# EasyEDA schematic SCH_BlackRacers.json

## Sheets
1 Sheet_1: TITLE: Electrical diagram; REV: 1.0; Date: 2021-05-08; Sheet: 1/1; Drawn By: Korabeynikov; Company: BlackRacers
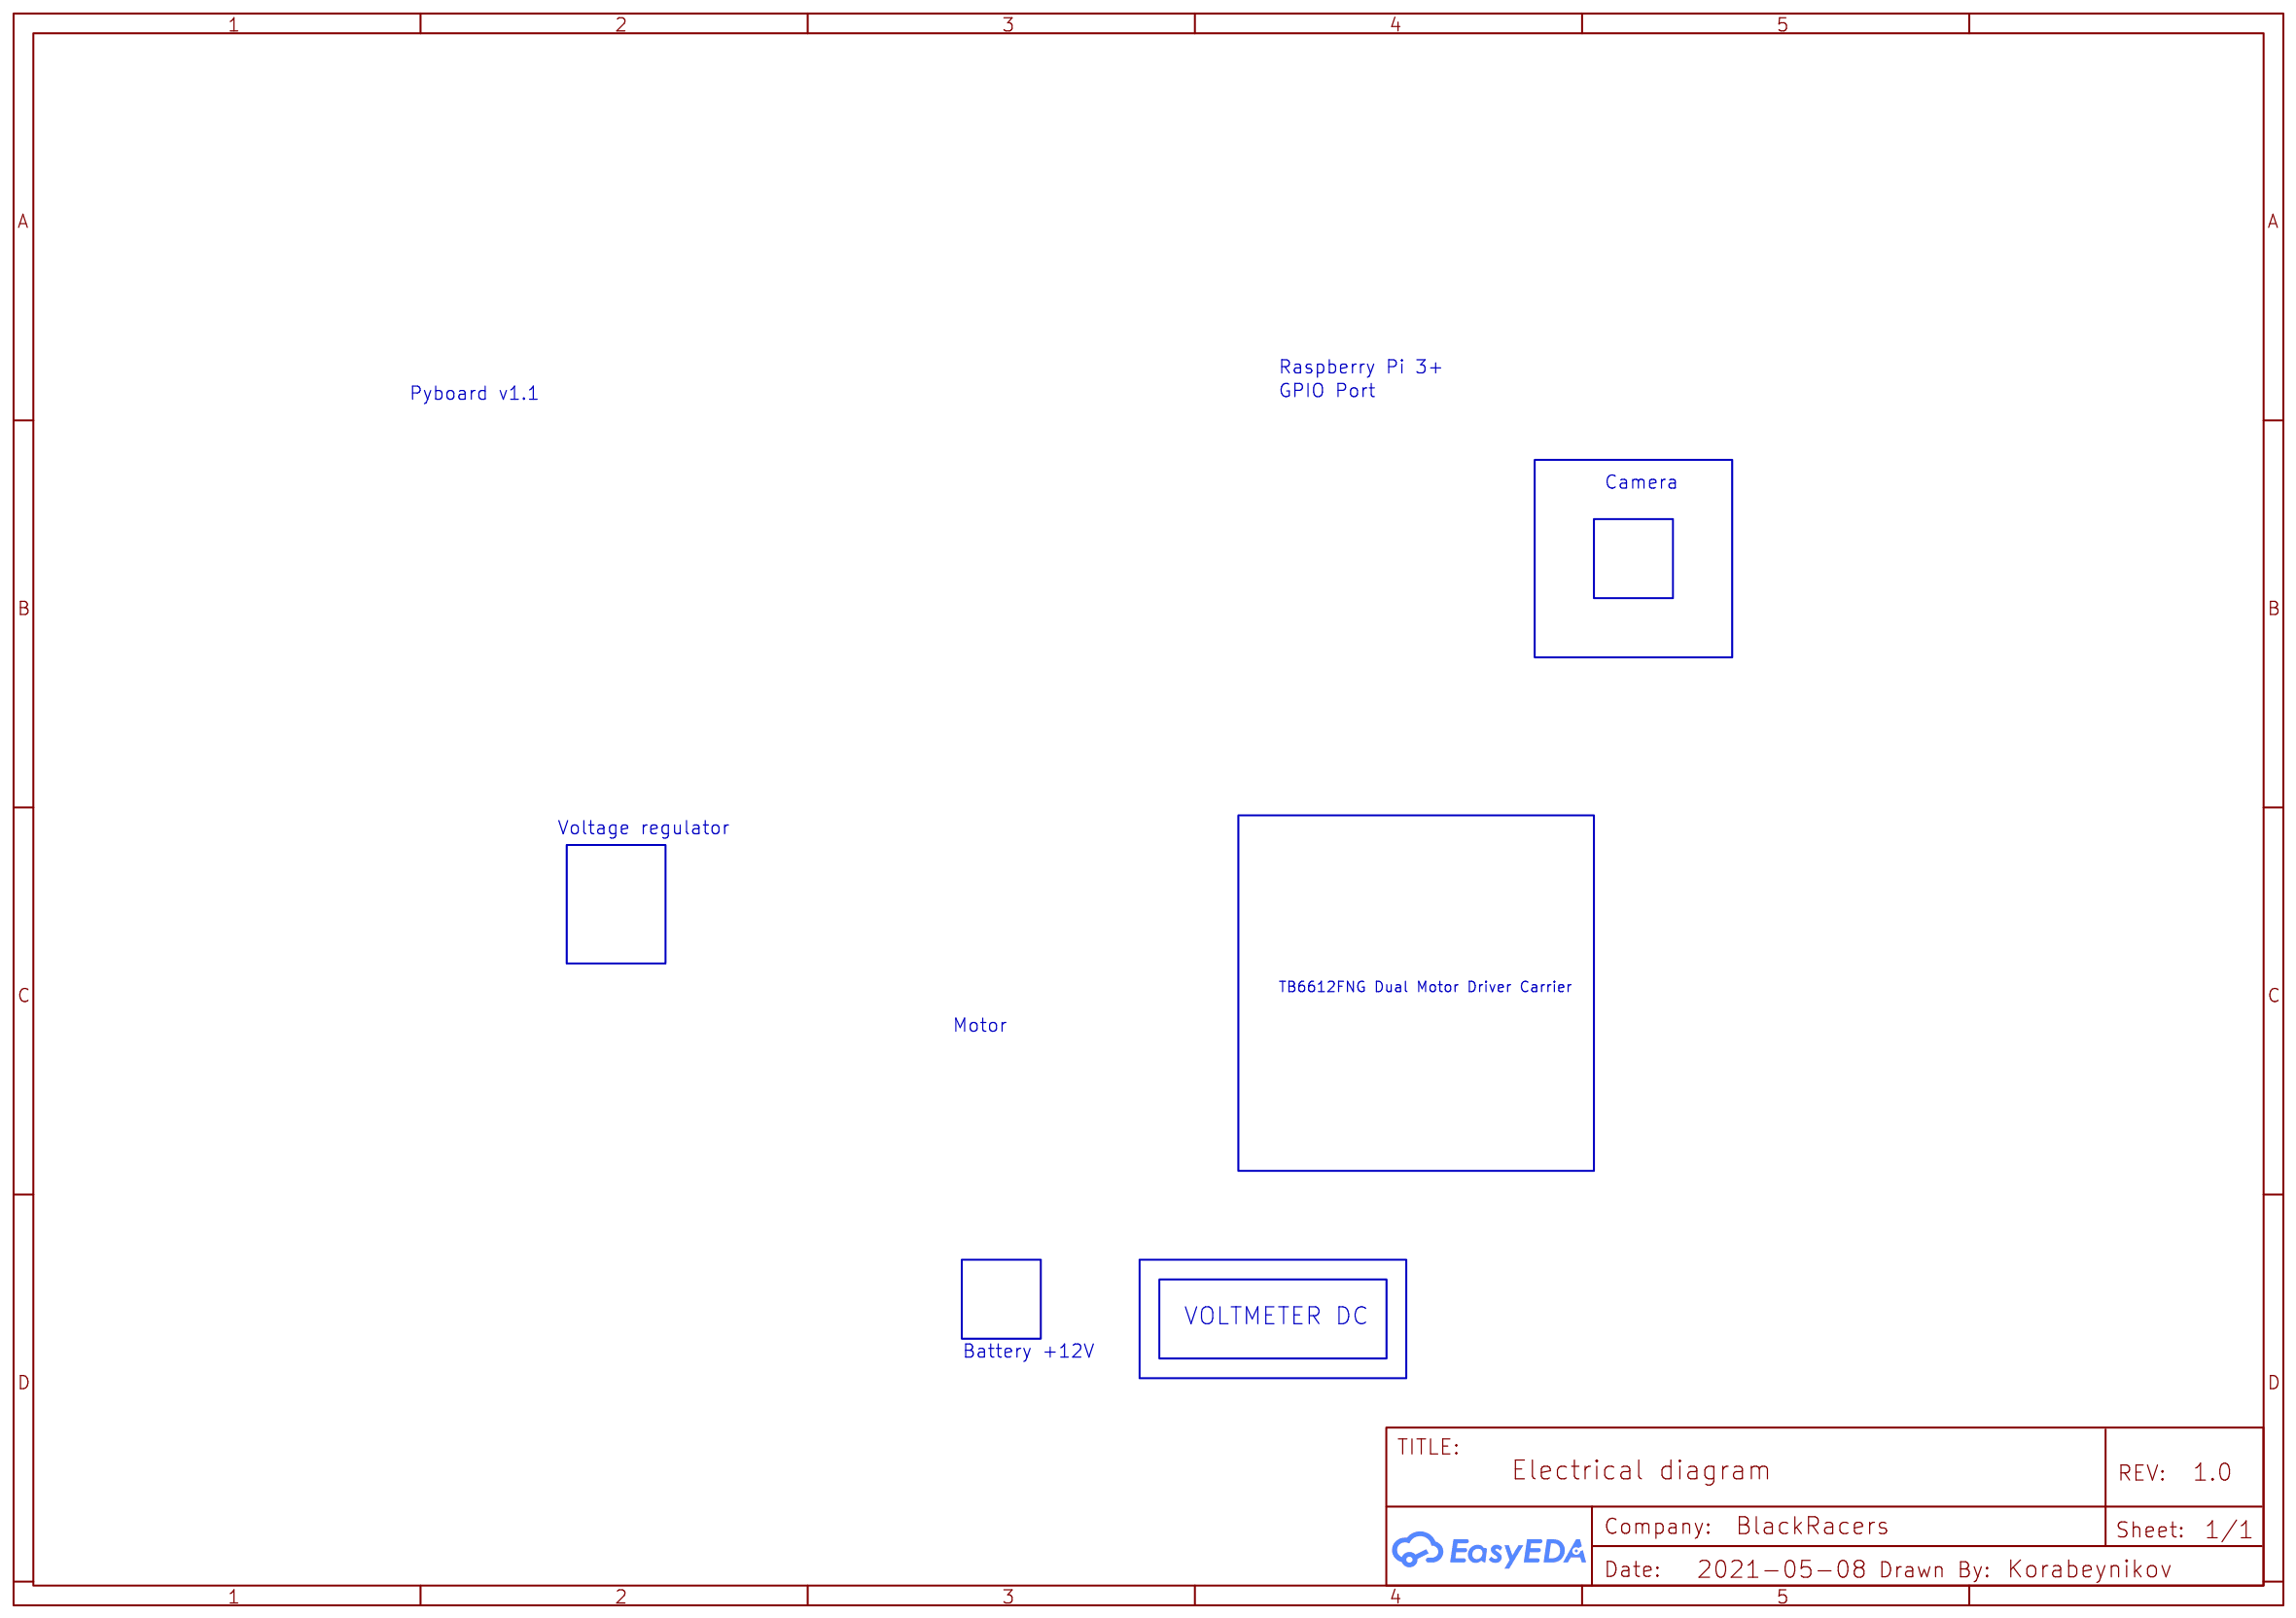
[diagram p0: Sheet_1]
2 Лист_2
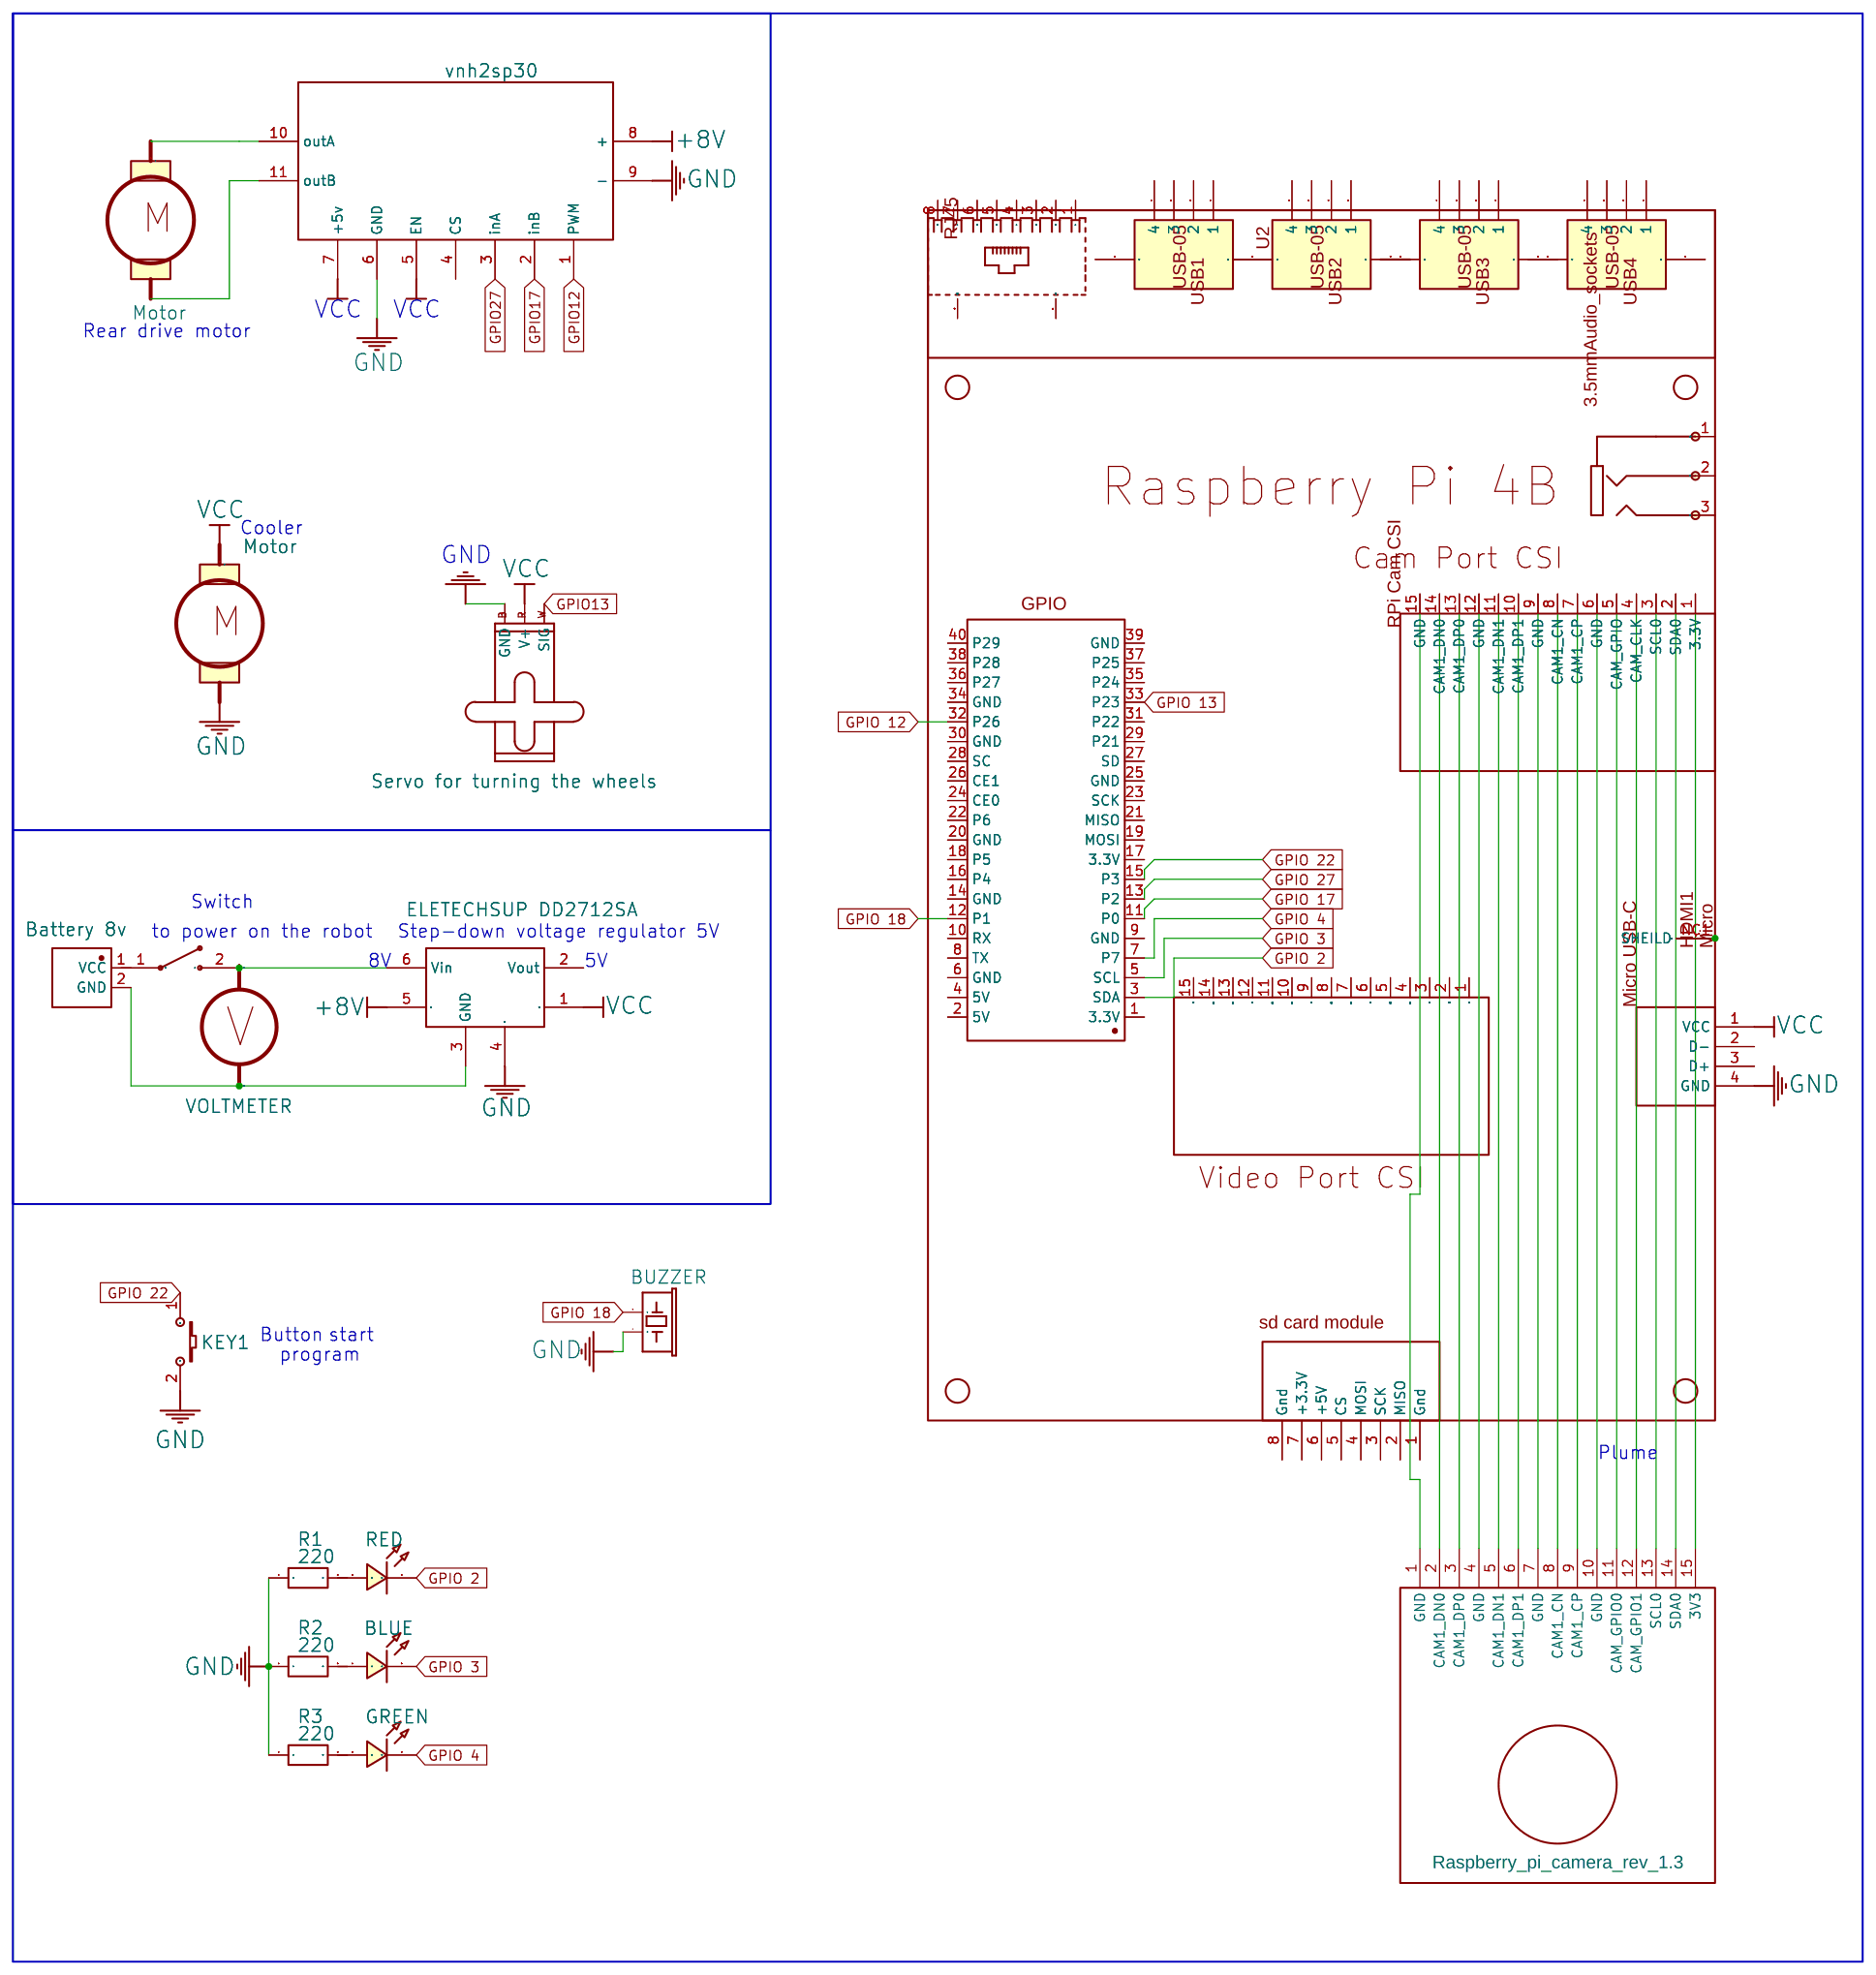
[diagram p1: Лист_2]

## Parts
BLUE  LED-0603_R  [LED0603_RED]
GREEN  LED-0603_R  [LED0603_RED]
KEY1  K2-3.6×6.1_SMD  [KEY-SMD_2P-L6.2-W3.6-LS8.0]
M1  Servo for turning the wheels  [1X03]
M2  Motor
M4  Motor
P1  VOLTMETER  [2PIN]
R1  220  [R0603]
R2  220  [R0603]
R3  220  [R0603]
RED  LED-0603_R  [LED0603_RED]
SG1  BUZZER  [BUZZER-12MM-NS-KIT]
U1  ELETECHSUP DD2712SA  [DD2712SA]
U2  vnh2sp30  [VNH2SP30-PACK]
U3  RaspberryPi4SpiceFile
U4  Battery 8v
U5  Raspberry_pi_camera_rev_1.3
U7  Botton

## Library data of the parts
BLUE GREEN RED = LED-0603_R: Manufacturer: EVERLIGHT(台湾亿光); Manufacturer Part: 19-217/R6C-AL1M2VY/3T; Supplier Part: C72044; Supplier: LCSC; Contributor: LCEDA_01
KEY1 = K2-3.6×6.1_SMD: Supplier Part: C118141; Supplier: LCSC; Manufacturer Part: K2-1107ST-A4SW-06; Contributor: LCEDA_Lib; 制造商: 韩国韩荣
M1 = SERVO: Contributor: ZegesMenden
M2 M4 = motor
P1 = VOLTMETER_XL
R1-R3 = R_0603_EU: Contributor: LCEDA_Lib
SG1 = BUZZER: Contributor: SparkFun
U1 = DD2712SA: Manufacturer: eletechsup; Supplier: Aliexpress; link: https://aliexpress.com/item/32817933017.html; Contributor: nivie
U2 = vnh2sp30: Contributor: gtf.crimea
U3 = RaspberryPi4SpiceFile: catid: 20; Contributor: leorprod; sim: true
U4 = Battery: Contributor: greandotcom
U5 = Raspberry_pi_camera_rev_1.3: Contributor: MiDem
U7 = Botton: Manufacturer: RSB; Manufacturer Part: 2A080; Supplier Part: 12131; Contributor: Krusad

## Nets
+8V: U1.5(Vin) U2.8(+)
GND: KEY1.2 M1.3(GND) R1.1 R2.1 R3.1 SG1.-(2) U1.4(GND) U2.6(GND) U2.9(-) U3.4(5V) U5.12(CAM_GPIO1)
VCC: M1.2(V+) U1.1(Vout) U2.5(EN) U2.7(+5v) U3.1(3.3V) U5.15(3V3)
GPIO12: U2.1(PWM)
GPIO13: M1.1(SIG)
GPIO17: U2.2(inB)
GPIO27: U2.3(inA)
GPIO 2: RED.2 U3.3(SDA) U5.13(SCL0)
GPIO 3: BLUE.2 U3.5(SCL) U5.11(CAM_GPIO0)
GPIO 4: GREEN.2 U3.7(P7) U5.9(CAM1_CP)
GPIO 12: U3.32(P26)
GPIO 13: U3.33(P23)
GPIO 17: U3.11(P0) U5.5(CAM1_DN1)
GPIO 18: SG1.+(1) U3.12(P1) U5.4(GND)
GPIO 22: KEY1.1 U3.15(P3) U5.1(GND)
GPIO 27: U3.13(P2) U5.3(CAM1_DP0)
Net-(P1-1): P1.1(A) U1.6(Vin) U7.2(1)
Net-(P1-2): P1.2(B) U1.3(GND) U4.2(GND)
Net-(U3-2): U3.2(5V) U5.14(SDA0)
Net-(U3-6): U3.6(GND) U5.10(GND)
Net-(U3-8): U3.8(TX) U5.8(CAM1_CN)
Net-(U3-9): U3.9(GND) U5.7(GND)
Net-(U3-10): U3.10(RX) U5.6(CAM1_DP1)
Net-(U3-14): U3.14(GND) U5.2(CAM1_DN0)
Net-(U3-NC1): U3.NC1(SHEILD) U3.NC2(SHEILD) U3.NC3(SHEILD) U3.NC4(SHEILD)

Not connected (* = marked no-connect by the designer): BLUE 1; GREEN 1; M2 2; M4 2; R1 2; R2 2; R3 2; RED 1; U1 2(Vout); U2 4(CS) 10(outA) 11(outB); U3 0 16(P4) 17(3.3V) 18(P5) 19(MOSI) 20(GND) 21(MISO) 22(P6) 23(SCK) 24(CE0) 25(GND) 26(CE1) 27(SD) 28(SC) 29(P21) 30(GND) 31(P22) 34(GND) 35(P24) 36(P27) 37(P25) 38(P28) 39(GND) 40(P29) S1(CASE1) S2(CASE2); U4 1(VCC); U7 1(2)

## Notes on the sheets
sheet 1
- Raspberry Pi 3+
- Pyboard v1.1
- GPIO Port
- Camera
- Voltage regulator
- TB6612FNG Dual Motor Driver Carrier
- Motor
- VOLTMETER DC
- Battery +12V
sheet 2
- Rear drive motor
- Cooler
- Switch
- to power on the robot
- Step-down voltage regulator 5V
- 8V
- 5V
- Button
- program
- start
- Plume
- Camera
